# Altium schematic sheet HBInterface.SchDoc
size A4; SheetNumber: 10; SheetTotal: 14
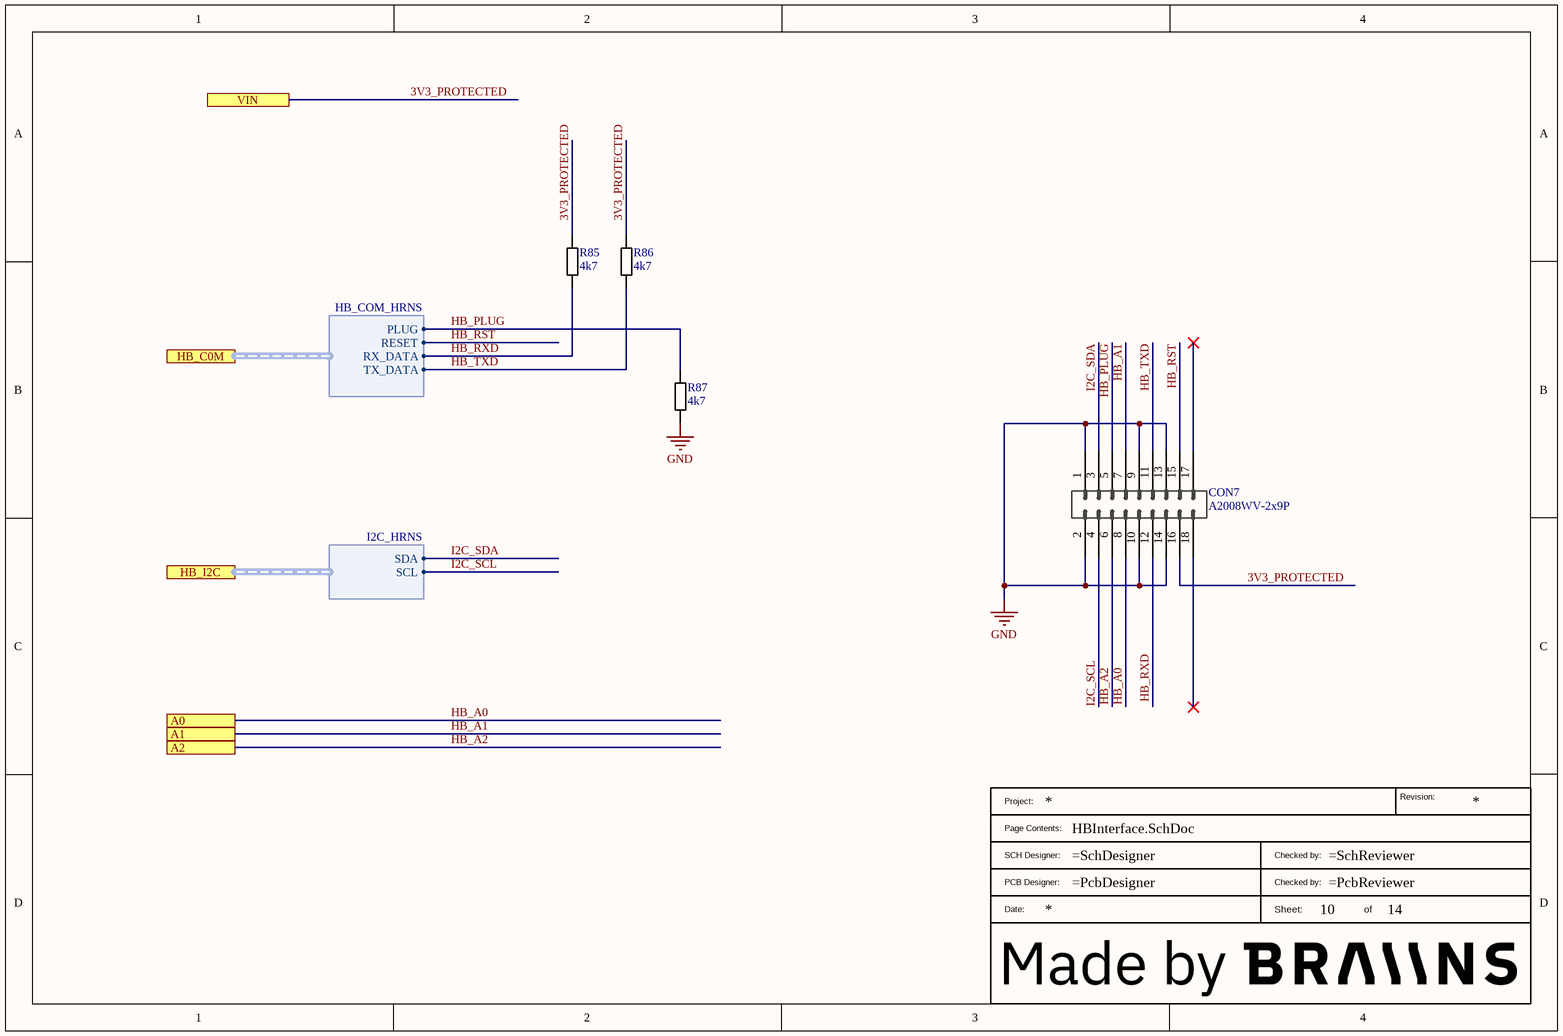
[diagram p0: HBInterface.SchDoc]

## Parts
?  BraiinsTitleBlockWithLogo  (value not drawn)  (graphical)
CON7  A2008WV-2x9P  [A2008WV-2X9P]
R85  4k7  [RES0402]
R86  4k7  [RES0402]
R87  4k7  [RES0402]

## Ports
A0, A1, A2, HB_C0M (harness HB_COM_HRNS), HB_I2C (harness I2C_HRNS), VIN

## Harnesses
HB_COM_HRNS: PLUG, RESET, RX_DATA, TX_DATA
I2C_HRNS: SDA, SCL

## Nets
GND: CON7.1 CON7.2 CON7.9 CON7.10 CON7.13 CON7.14 R87.2
3V3_PROTECTED: CON7.16 R85.1 R86.1 ; port VIN
HB_A0: CON7.8 ; port A0
HB_A1: CON7.7 ; port A1
HB_A2: CON7.6 ; port A2
HB_PLUG: CON7.5 R87.1 ; port HB_C0M.PLUG
HB_RST: CON7.15 ; port HB_C0M.RESET
HB_RXD: CON7.12 R85.2 ; port HB_C0M.RX_DATA
HB_TXD: CON7.11 R86.2 ; port HB_C0M.TX_DATA
I2C_SCL: CON7.4 ; port HB_I2C.SCL
I2C_SDA: CON7.3 ; port HB_I2C.SDA

Not connected (* = marked no-connect by the designer): CON7 17* 18*

## Notes on the sheet
- (in symbol BraiinsTitleBlockWithLogo) Revision:; Project:; Page Contents:; SCH Designer:; Checked by:; PCB Designer:; Date:; Sheet:; of

## Library data of the parts
CON7 = 30124: Connector THT, vertical, 2mm pitch; Manufacturer: CJT; Part_Status: New; ID: 30124; Updated By: janjuranek; Value: A2008WV-2x9P; Part_Type: Connector; Manufacturer Part Number: A2008WV-2x9P; Manufacturer Part Description: Connector THT, vertical, 2mm pitch; RoHS: Yes; Created By: janjuranek; Created_Date: 2023-03-23 13:37:15; Updated_Date: 2023-03-23 13:39:21; ComponentLink1Description: Datasheet; ComponentLink2Description: Supplier Part Details
R85-R87 = 30073: RES 4k7 Ohm 1% 0402; Part_Status: New; ID: 30073; Updated By: Jan; Sorted_Value: 4; Value: 4k7; Part_Type: Resistor; Manufacturer Part Description: RES 4k7 Ohm 1% 0402; Package_Case: 0402; RoHS: Yes; Temperature Range: -40 to +150C; Tolerance: 1%; Created By: Jan; Created_Date: 2023-03-02 13:15:12; Updated_Date: 2023-03-02 13:15:46; ComponentLink1Description: Datasheet; ComponentLink2Description: Supplier Part Details